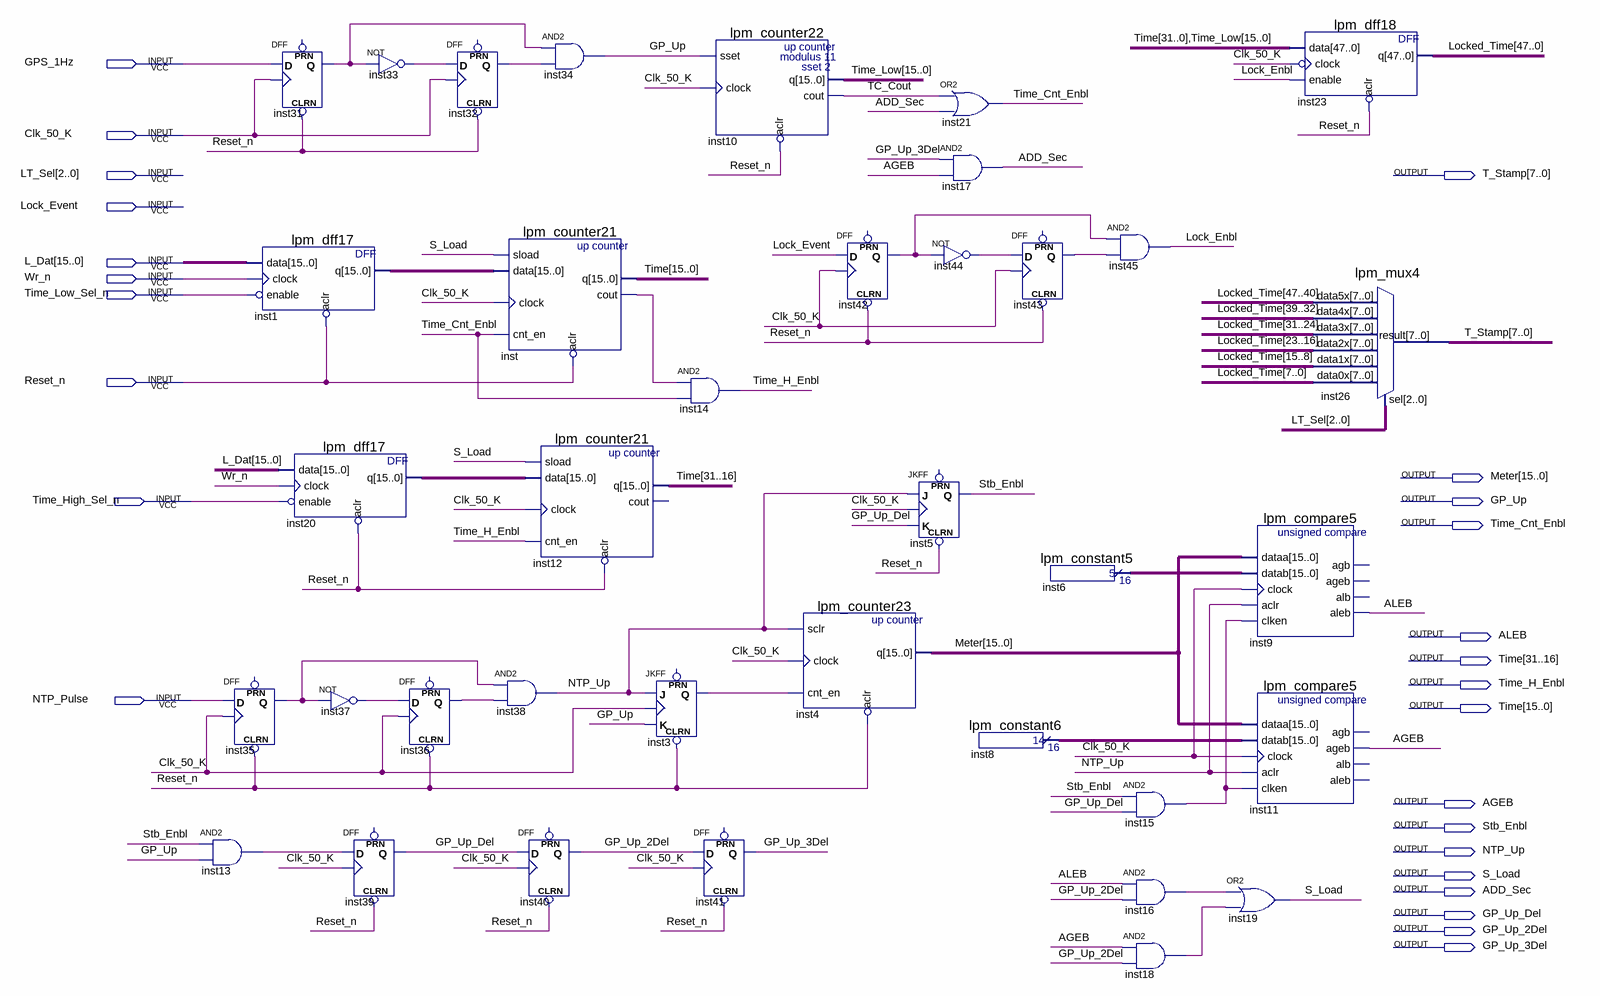
[diagram p0: schematic sheet]
// Quartus schematic Clock_Module.bdf as structural Verilog: 37 symbols, 26 pins
module Clock_Module (
  input  GPS_1Hz,
  input  Clk_50_K,
  input  [2:0] LT_Sel,
  input  Lock_Event,
  input  [15:0] L_Dat,
  input  Wr_n,
  input  Time_Low_Sel_n,
  input  Reset_n,
  input  Time_High_Sel_n,
  input  NTP_Pulse,
  output [7:0] T_Stamp,
  output [15:0] Meter,
  output GP_Up,
  output Time_Cnt_Enbl,
  output ALEB,
  output [31:0] Time,
  output Time_H_Enbl,
  output AGEB,
  output Stb_Enbl,
  output NTP_Up,
  output S_Load,
  output ADD_Sec,
  output GP_Up_Del,
  output GP_Up_2Del,
  output GP_Up_3Del
);

  wire inst3_q, inst13_out, inst15_out, inst16_out, inst18_out, inst31_q, inst32_q, inst33_out, inst35_q,
       inst36_q, inst37_out, inst42_q, inst43_q, inst44_out, inst_cout, Lock_Enbl, TC_Cout;
  wire [15:0] inst1_q, inst6_result, inst8_result, inst20_q, Time_Low;
  wire [47:0] Locked_Time;

  DFF inst35 (.CLRN(Reset_n), .CLK(Clk_50_K), .D(NTP_Pulse), .Q(inst35_q));  // open: PRN
  and inst13 (inst13_out, Stb_Enbl, GP_Up);
  DFF inst31 (.CLRN(Reset_n), .CLK(Clk_50_K), .D(GPS_1Hz), .Q(inst31_q));  // open: PRN
  lpm_dff17 inst1 (.data(L_Dat), .clock(Wr_n), .enable(~Time_Low_Sel_n), .aclr(~Reset_n), .q(inst1_q));
  lpm_dff17 inst20 (.data(L_Dat), .clock(Wr_n), .enable(~Time_High_Sel_n), .aclr(~Reset_n), .q(inst20_q));
  not inst33 (inst33_out, inst31_q);
  not inst37 (inst37_out, inst35_q);
  DFF inst39 (.CLRN(Reset_n), .CLK(Clk_50_K), .D(inst13_out), .Q(GP_Up_Del));  // open: PRN
  DFF inst36 (.CLRN(Reset_n), .CLK(Clk_50_K), .D(inst37_out), .Q(inst36_q));  // open: PRN
  DFF inst32 (.CLRN(Reset_n), .CLK(Clk_50_K), .D(inst33_out), .Q(inst32_q));  // open: PRN
  lpm_counter21 inst (
    .sload(S_Load), .data(inst1_q), .clock(Clk_50_K), .cnt_en(Time_Cnt_Enbl), .aclr(~Reset_n),
    .q(Time[15:0]), .cout(inst_cout));
  and inst38 (NTP_Up, inst35_q, inst36_q);
  and inst34 (GP_Up, inst31_q, inst32_q);
  lpm_counter21 inst12 (
    .sload(S_Load), .data(inst20_q), .clock(Clk_50_K), .cnt_en(Time_H_Enbl), .aclr(~Reset_n), .q(Time[31:16]));  // open: cout
  DFF inst40 (.CLRN(Reset_n), .CLK(Clk_50_K), .D(GP_Up_Del), .Q(GP_Up_2Del));  // open: PRN
  and inst14 (Time_H_Enbl, inst_cout, Time_Cnt_Enbl);
  JKFF inst3 (.CLRN(Reset_n), .K(GP_Up), .J(NTP_Up), .CLK(Clk_50_K), .Q(inst3_q));  // open: PRN
  lpm_counter22 inst10 (.sset(GP_Up), .clock(Clk_50_K), .aclr(~Reset_n), .q(Time_Low), .cout(TC_Cout));
  DFF inst41 (.CLRN(Reset_n), .CLK(Clk_50_K), .D(GP_Up_2Del), .Q(GP_Up_3Del));  // open: PRN
  lpm_counter23 inst4 (.sclr(NTP_Up), .clock(Clk_50_K), .cnt_en(inst3_q), .aclr(~Reset_n), .q(Meter));
  DFF inst42 (.CLRN(Reset_n), .CLK(Clk_50_K), .D(Lock_Event), .Q(inst42_q));  // open: PRN
  or inst21 (Time_Cnt_Enbl, TC_Cout, ADD_Sec);
  and inst17 (ADD_Sec, GP_Up_3Del, AGEB);
  not inst44 (inst44_out, inst42_q);
  JKFF inst5 (.CLRN(Reset_n), .K(GP_Up_Del), .J(NTP_Up), .CLK(Clk_50_K), .Q(Stb_Enbl));  // open: PRN
  lpm_constant6 inst8 (.result(inst8_result));
  DFF inst43 (.CLRN(Reset_n), .CLK(Clk_50_K), .D(inst44_out), .Q(inst43_q));  // open: PRN
  lpm_constant5 inst6 (.result(inst6_result));
  and inst45 (Lock_Enbl, inst42_q, inst43_q);
  and inst15 (inst15_out, Stb_Enbl, GP_Up_Del);
  and inst16 (inst16_out, ALEB, GP_Up_2Del);
  and inst18 (inst18_out, AGEB, GP_Up_2Del);
  lpm_compare5 inst9 (
    .dataa(Meter), .datab(inst6_result), .clock(Clk_50_K), .aclr(NTP_Up), .clken(inst15_out), .aleb(ALEB));  // open: agb, ageb, alb
  lpm_compare5 inst11 (
    .dataa(Meter), .datab(inst8_result), .clock(Clk_50_K), .aclr(NTP_Up), .clken(inst15_out), .ageb(AGEB));  // open: agb, alb, aleb
  or inst19 (S_Load, inst16_out, inst18_out);
  lpm_dff18 inst23 (.data({Time, Time_Low}), .clock(~Clk_50_K), .enable(Lock_Enbl), .aclr(~Reset_n), .q(Locked_Time));
  lpm_mux4 inst26 (
    .data5x(Locked_Time[47:40]), .data4x(Locked_Time[39:32]), .data3x(Locked_Time[31:24]),
    .data2x(Locked_Time[23:16]), .data1x(Locked_Time[15:8]), .data0x(Locked_Time[7:0]), .sel(LT_Sel),
    .result(T_Stamp));
endmodule
